# Altium schematic sheet octopus_sch.SchDoc
size 420 x 297 mm; SheetNumber: 1; SheetTotal: 1
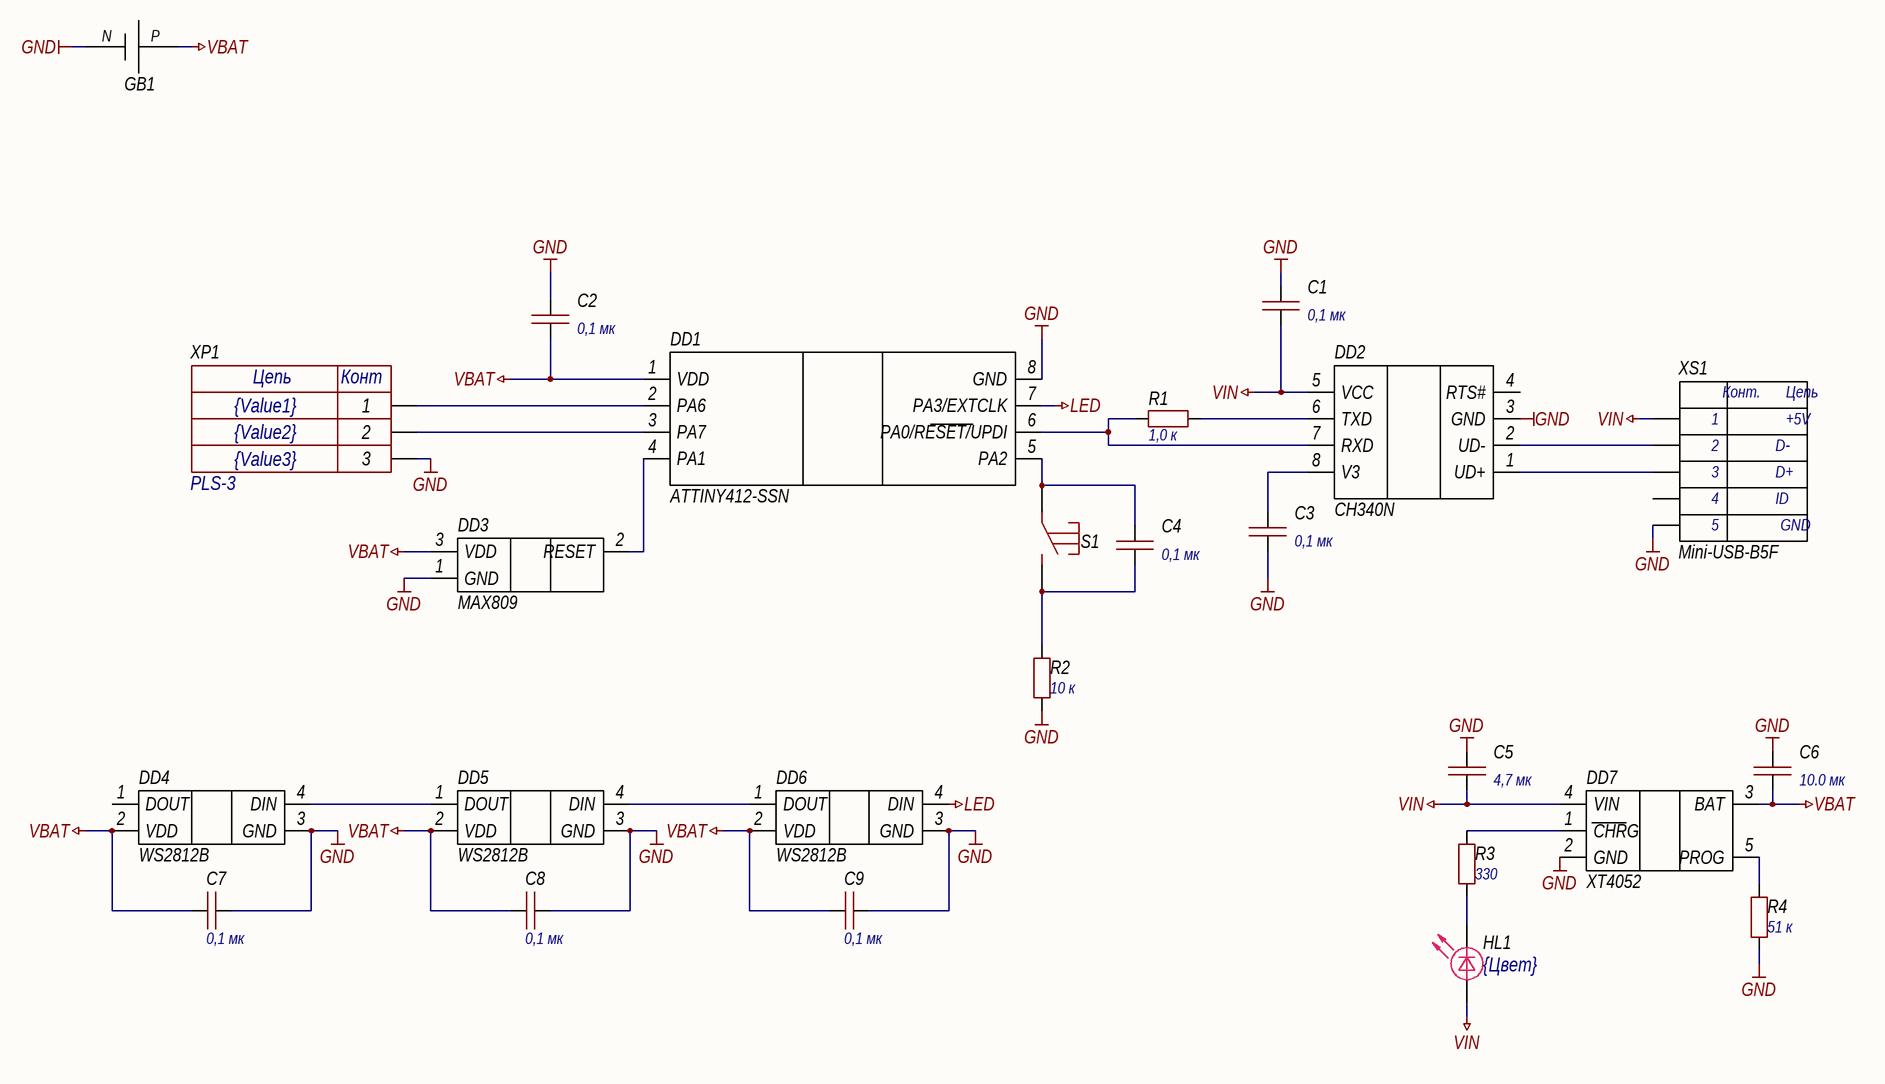
[diagram p0: octopus_sch.SchDoc]

## Parts
C1  value 0,1 мк  [THT CAP]  (hidden comment: Capacitor)
C2  value 0,1 мк  [THT CAP]  (hidden comment: Capacitor)
C3  value 0,1 мк  [THT CAP]  (hidden comment: Capacitor)
C4  value 0,1 мк  [THT CAP]  (hidden comment: Capacitor)
C5  value 4,7 мк  [THT CAP]  (hidden comment: Capacitor)
C6  value 10.0 мк  [THT CAP]  (hidden comment: Capacitor)
C7  value 0,1 мк  [THT CAP]  (hidden comment: Capacitor)
C8  value 0,1 мк  [THT CAP]  (hidden comment: Capacitor)
C9  value 0,1 мк  [THT CAP]  (hidden comment: Capacitor)
DD1  ATTINY412-SSN  [SOIC-8]
DD2  CH340N  [SOP8]
DD3  MAX809  [SOT23-3]
DD4  WS2812B  [LED RGB horizontal]
DD5  WS2812B  [LED_RGB_5MM]
DD6  WS2812B  [LED_RGB_5MM]
DD7  XT4052  [SOT23-5]
GB1  L-KLS5-CR2032-03  [L-KLS5-CR2032-03]  (value not drawn)
HL1  Color: {Цвет}  [3mm_led_red]  (hidden comment: LED)
R1  value 1,0 к  [RES_THT_025W_1k]  (hidden comment: Resistor)
R2  value 10 к  [RES_THT_025W_10k]  (hidden comment: Resistor)
R3  value 330  [RES_THT_025W_1k]  (hidden comment: Resistor)
R4  value 51 к  [RES_THT_025W_100k]  (hidden comment: Resistor)
S1  KLS7-TS3601  [KLS7-TS3601]  (value not drawn)
XP1  PLS-3  Value3: {Value3}  Value2: {Value2}  Value1: {Value1}  [PLS3]
XS1  Mini-USB-B5F  [KLS1-229-5FA]

## Nets
GND: C1.1 C2.1 C3.1 C5.1 C6.1 C7.2 C8.2 C9.2 DD1.8(GND) DD2.3(GND) DD3.1(GND) DD4.3(GND) DD5.3(GND) DD6.3(GND) DD7.2(GND) GB1.N R2.2 R4.1 XP1.3 XS1.5
LED: DD1.7(PA3/EXTCLK) DD6.4(DIN)
VBAT: C2.2 C6.2 C7.1 C8.1 C9.1 DD1.1(VDD) DD3.3(VDD) DD4.2(VDD) DD5.2(VDD) DD6.2(VDD) DD7.3(BAT) GB1.P
VIN: C1.2 C5.2 DD2.5(VCC) DD7.4(VIN) HL1.1 XS1.1
NetC3_2: C3.2 DD2.8(V3)
NetC4_1: C4.1 R2.1 S1.2
NetC4_2: C4.2 DD1.5(PA2) S1.1
NetDD1_2: DD1.2(PA6) XP1.1
NetDD1_3: DD1.3(PA7) XP1.2
NetDD1_4: DD1.4(PA1) DD3.2(RESET)
NetDD1_6: DD1.6(PA0/RESET/UPDI) DD2.7(RXD) R1.1
NetDD2_1: DD2.1(UD+) XS1.3
NetDD2_2: DD2.2(UD-) XS1.2
NetDD2_6: DD2.6(TXD) R1.2
NetDD4_4: DD4.4(DIN) DD5.1(DOUT)
NetDD5_4: DD5.4(DIN) DD6.1(DOUT)
NetDD7_1: DD7.1(CHRG) R3.2
NetDD7_5: DD7.5(PROG) R4.2
NetHL1_2: HL1.2 R3.1

Not connected (* = marked no-connect by the designer): DD2 4(RTS#); DD4 1(DOUT); XS1 4

## Notes on the sheet
- Перв. примен.
- Справ. №
- Подп. и дата
- Инв. № дубл.
- Взам. инв. №
- Разраб.
- Изм.
- Лист
- № докум.
- Подп.
- Дата
- Лит.
- Масса
- Масштаб
- Пров.
- Т.контр.
- Схема электрическая принципиальная
- Листов
- Инв. № подл.
- Утв.
- Н.контр.
- Копировал
- Формат А3
- (in symbol Mini-USB-B5F) Конт.; Цепь; +5V; D-; D+; ID; GND
- (in symbol PLS-3) Цепь; Конт

## Library data of the parts
C1-C9 = 0,1 мк: Конденсатор; Part Number: Capacitor
DD1 = ATTINY412-SSN: Микроконтроллер; Part Number: ATTINY412-SSN
DD2 = CH340N: Преобразователь интерфейса USB в UART; Автор: klegot; Part Number: CH340N; Datasheet: https://static.chipdip.ru/lib/375/DOC030375417.pdf
DD3 = MAX809: Формирователь импульса сброса (супервизор питания); Автор: klegot; Part Number: MAX809; Datasheet: https://static.chipdip.ru/lib/848/DOC018848681.pdf
DD4-DD6 = WS2812B: Адресный светодиод; Автор: klegot; Part Number: WS2812B; Datasheet: https://static.chipdip.ru/lib/554/DOC001554925.pdf
DD7 = XT4052: Контроллер заряда Li-Ion аккумуляторов, 4.2 В; Автор: klegot; Part Number: XT4052; Datasheet: https://orion43.ru/datasheets/34208.pdf?ysclid=mr598nxlrz92742175
GB1 = L-KLS5-CR2032-03: Держатель батареи CR2032; Автор: klegot; Part Number: L-KLS5-CR2032-03; Datasheet: https://static.chipdip.ru/lib/516/DOC014516710.pdf
HL1 = LED: Светодиод; Part Number: LED
R1 R3 = Resistor_1.0k_1_0603: Резистор номиналом 1,0 кОм 1%; Power: *; Part Number: Resistor_1.0k_1_0603; Tolerance: 1%
R2 = Resistor_10k_1_0603: Резистор номиналом 10 кОм 1%; Power: *; Part Number: Resistor_10k_1_0603; Tolerance: 1%
R4 = Resistor_100k_1_0603: Резистор номиналом 100 кОм 1%; Power: *; Part Number: Resistor_100k_1_0603; Tolerance: 1%
S1 = KLS7-TS3601: Тактовая кнопка; Автор: klegot; Part Number: KLS7-TS3601; Datasheet: https://static.chipdip.ru/lib/551/DOC001551910.pdf
XP1 = PLS-3: Гребенка 3 пина; System: Connector; Автор: rreali; Part Number: PLS-3; Datasheet: https://static.chipdip.ru/lib/177/DOC040177951.pdf
XS1 = Mini-USB-B5F: Разъем mini USB, розетка угловая на плату; Автор: klegot; Part Number: Mini-USB-B5F; Datasheet: https://static.chipdip.ru/lib/743/DOC016743759.pdf